# Altium schematic sheet LPDDR4 SDRAM_2.SchDoc
size 420 x 297 mm; SheetNumber: 13; SheetTotal: 26
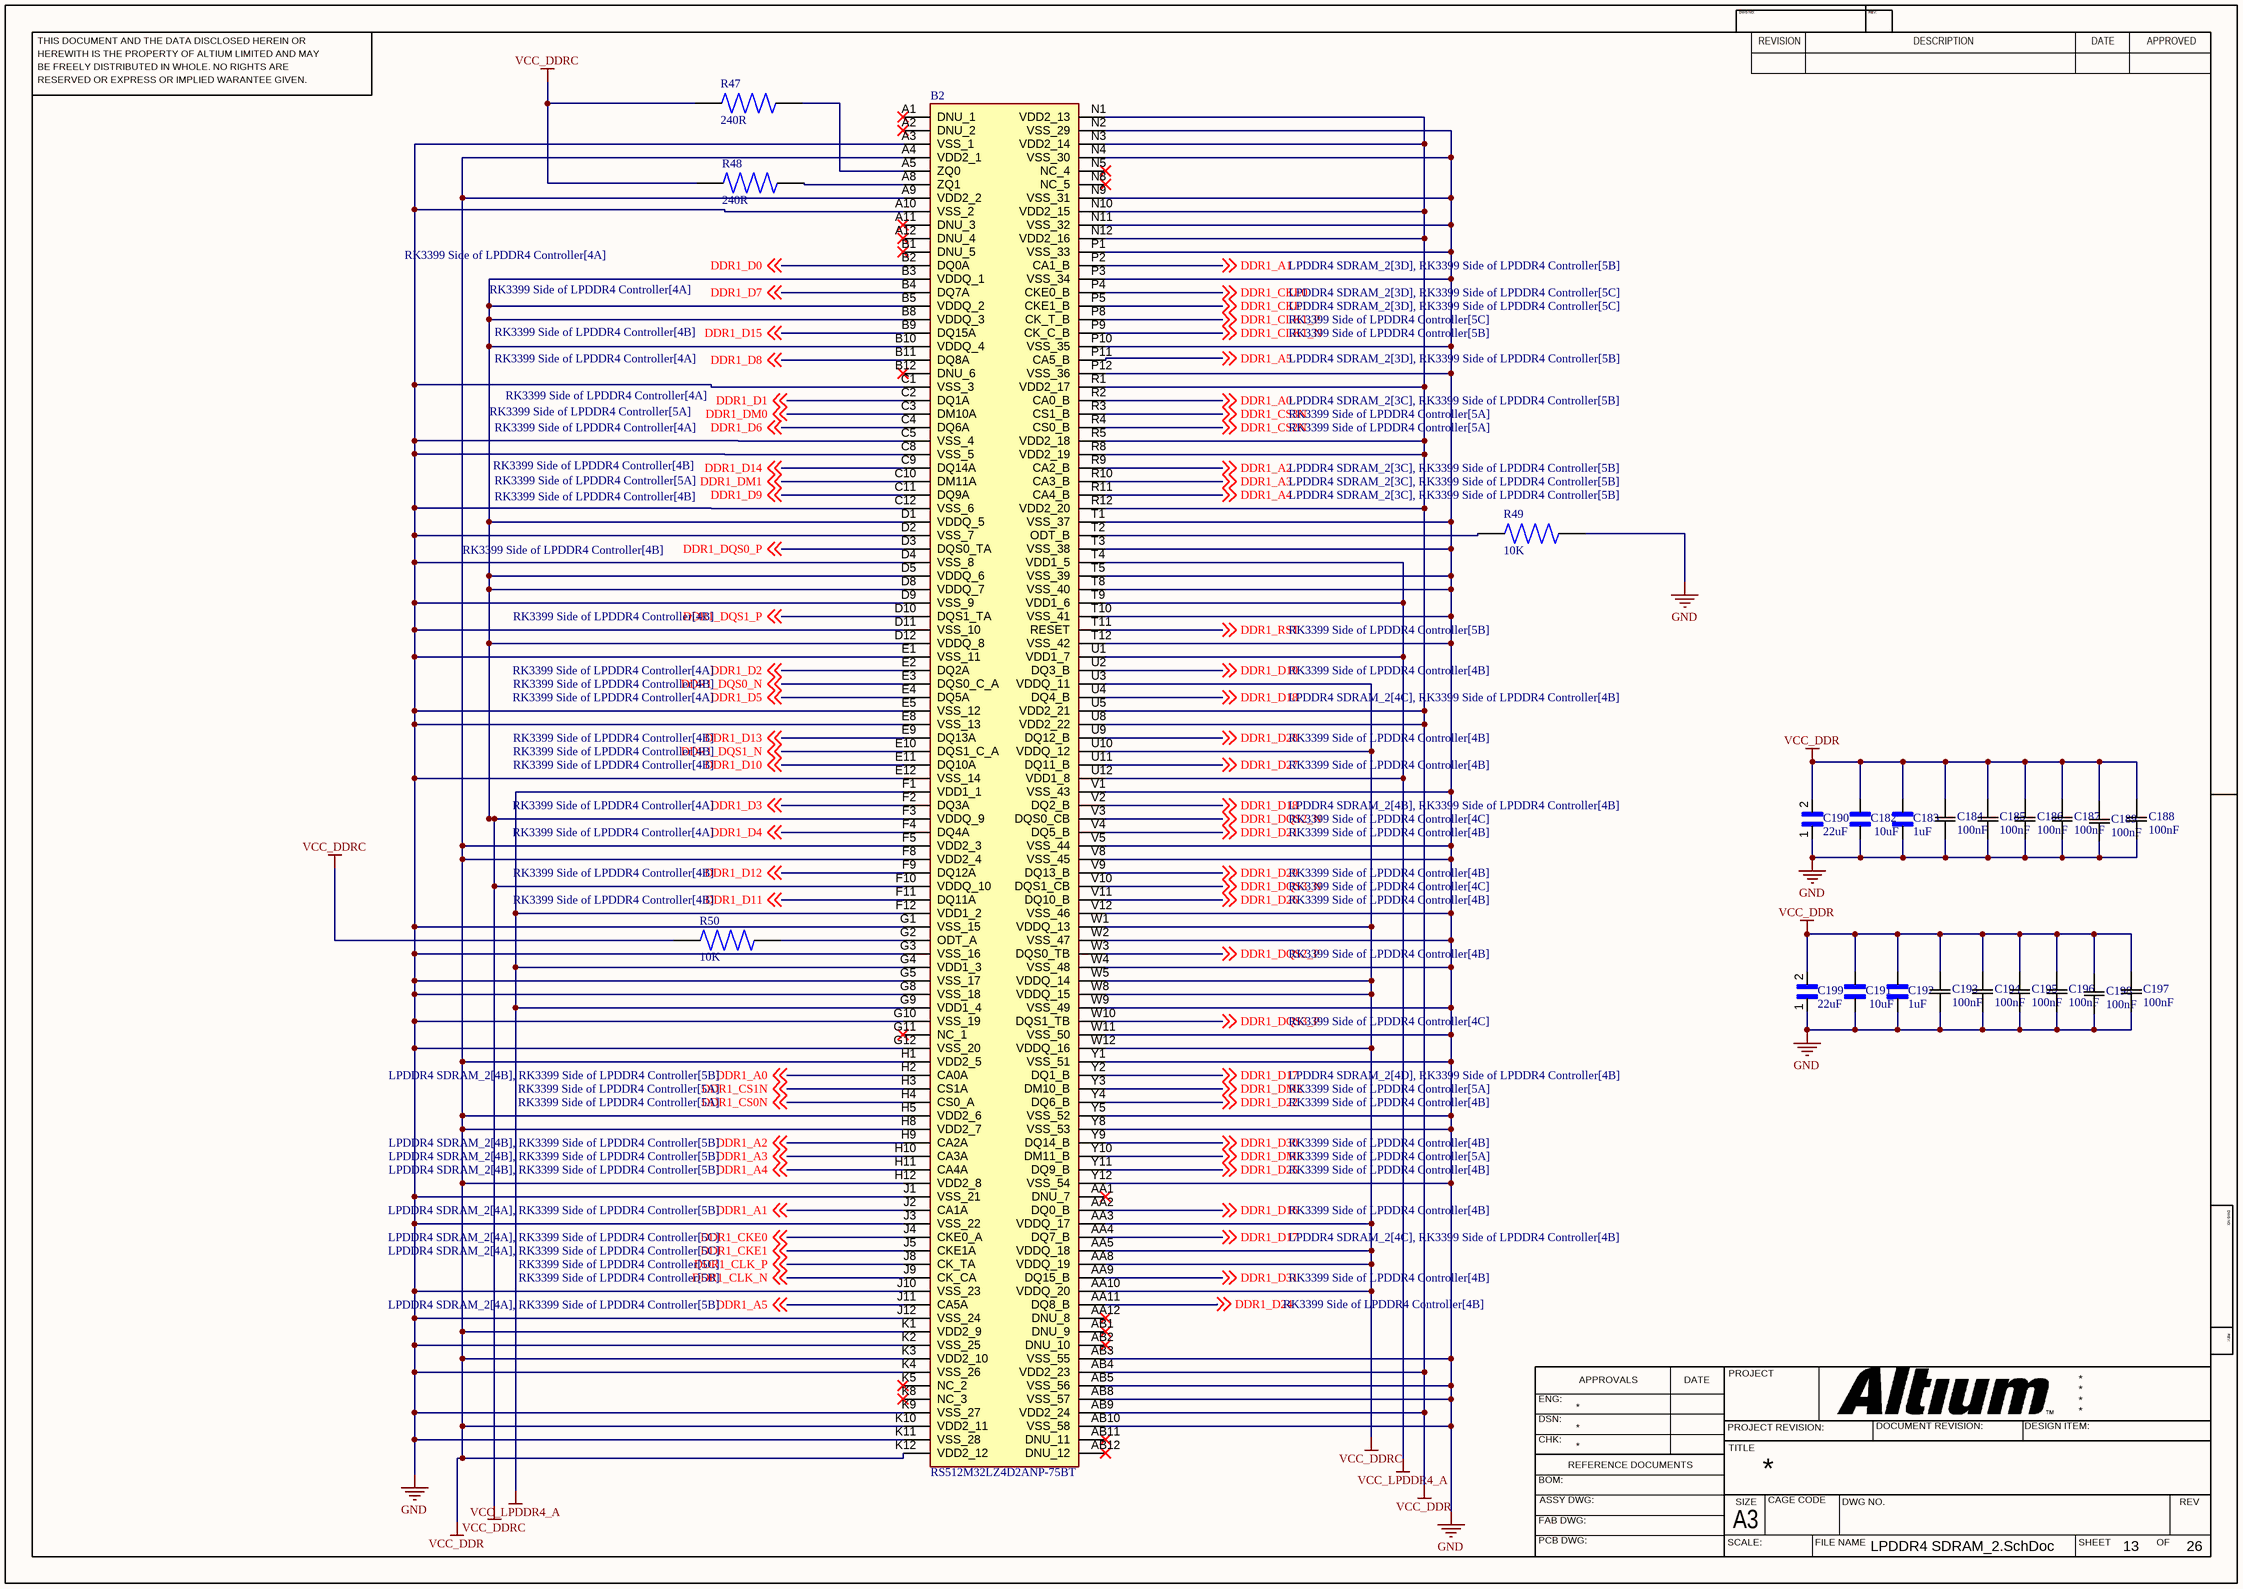
[diagram p0: LPDDR4 SDRAM_2.SchDoc]

## Parts
B2  RS512M32LZ4D2ANP-75BT  [BGA200C65P12X22_1000X1500X100]
C182  10uF  [CAPC1005X70N]
C183  1uF  [CAPC1005X56N]
C184  100nF  [CAP_1005_TDK]
C185  100nF  [CAP_1005_TDK]
C186  100nF  [CAP_1005_TDK]
C187  100nF  [CAP_1005_TDK]
C188  100nF  [CAP_1005_TDK]
C189  100nF  [CAP_1005_TDK]
C190  22uF  [CAPC6050X550N]
C191  10uF  [CAPC1005X70N]
C192  1uF  [CAPC1005X56N]
C193  100nF  [CAP_1005_TDK]
C194  100nF  [CAP_1005_TDK]
C195  100nF  [CAP_1005_TDK]
C196  100nF  [CAP_1005_TDK]
C197  100nF  [CAP_1005_TDK]
C198  100nF  [CAP_1005_TDK]
C199  22uF  [CAPC6050X550N]
R47  240R  [RESC1608X50N]
R48  240R  [RESC1608X50N]
R49  10K  [RESC1608X55N]
R50  10K  [RESC1608X55N]

## Nets
GND: B2.A3(VSS_1) B2.A10(VSS_2) B2.AB3(VSS_55) B2.AB5(VSS_56) B2.AB8(VSS_57) B2.AB10(VSS_58) B2.C1(VSS_3) B2.C5(VSS_4) B2.C8(VSS_5) B2.C12(VSS_6) B2.D2(VSS_7) B2.D4(VSS_8) B2.D9(VSS_9) B2.D11(VSS_10) B2.E1(VSS_11) B2.E5(VSS_12) B2.E8(VSS_13) B2.E12(VSS_14) B2.G1(VSS_15) B2.G3(VSS_16) B2.G5(VSS_17) B2.G8(VSS_18) B2.G10(VSS_19) B2.G12(VSS_20) B2.J1(VSS_21) B2.J3(VSS_22) B2.J10(VSS_23) B2.J12(VSS_24) B2.K2(VSS_25) B2.K4(VSS_26) B2.K9(VSS_27) B2.K11(VSS_28) B2.N2(VSS_29) B2.N4(VSS_30) B2.N9(VSS_31) B2.N11(VSS_32) B2.P1(VSS_33) B2.P3(VSS_34) B2.P10(VSS_35) B2.P12(VSS_36) B2.T1(VSS_37) B2.T3(VSS_38) B2.T5(VSS_39) B2.T8(VSS_40) B2.T10(VSS_41) B2.T12(VSS_42) B2.V1(VSS_43) B2.V5(VSS_44) B2.V8(VSS_45) B2.V12(VSS_46) B2.W2(VSS_47) B2.W4(VSS_48) B2.W9(VSS_49) B2.W11(VSS_50) B2.Y1(VSS_51) B2.Y5(VSS_52) B2.Y8(VSS_53) B2.Y12(VSS_54) C182.1 C183.1 C184.1 C185.1 C186.1 C187.1 C188.1 C189.1 C190.1 C191.1 C192.1 C193.1 C194.1 C195.1 C196.1 C197.1 C198.1 C199.1 R49.2
VCC_DDR: B2.A4(VDD2_1) B2.A9(VDD2_2) B2.AB4(VDD2_23) B2.AB9(VDD2_24) B2.F5(VDD2_3) B2.F8(VDD2_4) B2.H1(VDD2_5) B2.H5(VDD2_6) B2.H8(VDD2_7) B2.H12(VDD2_8) B2.K1(VDD2_9) B2.K3(VDD2_10) B2.K10(VDD2_11) B2.K12(VDD2_12) B2.N1(VDD2_13) B2.N3(VDD2_14) B2.N10(VDD2_15) B2.N12(VDD2_16) B2.R1(VDD2_17) B2.R5(VDD2_18) B2.R8(VDD2_19) B2.R12(VDD2_20) B2.U5(VDD2_21) B2.U8(VDD2_22) C182.2 C183.2 C184.2 C185.2 C186.2 C187.2 C188.2 C189.2 C190.2 C191.2 C192.2 C193.2 C194.2 C195.2 C196.2 C197.2 C198.2 C199.2
VCC_DDRC: B2.AA3(VDDQ_17) B2.AA5(VDDQ_18) B2.AA8(VDDQ_19) B2.AA10(VDDQ_20) B2.B3(VDDQ_1) B2.B5(VDDQ_2) B2.B8(VDDQ_3) B2.B10(VDDQ_4) B2.D1(VDDQ_5) B2.D5(VDDQ_6) B2.D8(VDDQ_7) B2.D12(VDDQ_8) B2.F3(VDDQ_9) B2.F10(VDDQ_10) B2.U3(VDDQ_11) B2.U10(VDDQ_12) B2.W1(VDDQ_13) B2.W5(VDDQ_14) B2.W8(VDDQ_15) B2.W12(VDDQ_16) R47.1 R48.1 R50.2
VCC_LPDDR4_A: B2.F1(VDD1_1) B2.F12(VDD1_2) B2.G4(VDD1_3) B2.G9(VDD1_4) B2.T4(VDD1_5) B2.T9(VDD1_6) B2.U1(VDD1_7) B2.U12(VDD1_8)
DDR1_A0: B2.H2(CA0A) B2.R2(CA0_B) ; off-sheet DDR1_A0
DDR1_A1: B2.J2(CA1A) B2.P2(CA1_B) ; off-sheet DDR1_A1
DDR1_A2: B2.H9(CA2A) B2.R9(CA2_B) ; off-sheet DDR1_A2
DDR1_A3: B2.H10(CA3A) B2.R10(CA3_B) ; off-sheet DDR1_A3
DDR1_A4: B2.H11(CA4A) B2.R11(CA4_B) ; off-sheet DDR1_A4
DDR1_A5: B2.J11(CA5A) B2.P11(CA5_B) ; off-sheet DDR1_A5
DDR1_CKE0: B2.J4(CKE0_A) B2.P4(CKE0_B) ; off-sheet DDR1_CKE0
DDR1_CKE1: B2.J5(CKE1A) B2.P5(CKE1_B) ; off-sheet DDR1_CKE1
DDR1_CLK1_N: B2.P9(CK_C_B) ; off-sheet DDR1_CLK1_N
DDR1_CLK1_P: B2.P8(CK_T_B) ; off-sheet DDR1_CLK1_P
DDR1_CLK_N: B2.J9(CK_CA) ; off-sheet DDR1_CLK_N
DDR1_CLK_P: B2.J8(CK_TA) ; off-sheet DDR1_CLK_P
DDR1_CS0N: B2.H4(CS0_A) ; off-sheet DDR1_CS0N
DDR1_CS1N: B2.H3(CS1A) ; off-sheet DDR1_CS1N
DDR1_CS2N: B2.R4(CS0_B) ; off-sheet DDR1_CS2N
DDR1_CS3N: B2.R3(CS1_B) ; off-sheet DDR1_CS3N
DDR1_D0: B2.B2(DQ0A) ; off-sheet DDR1_D0
DDR1_D1: B2.C2(DQ1A) ; off-sheet DDR1_D1
DDR1_D2: B2.E2(DQ2A) ; off-sheet DDR1_D2
DDR1_D3: B2.F2(DQ3A) ; off-sheet DDR1_D3
DDR1_D4: B2.F4(DQ4A) ; off-sheet DDR1_D4
DDR1_D5: B2.E4(DQ5A) ; off-sheet DDR1_D5
DDR1_D6: B2.C4(DQ6A) ; off-sheet DDR1_D6
DDR1_D7: B2.B4(DQ7A) ; off-sheet DDR1_D7
DDR1_D8: B2.B11(DQ8A) ; off-sheet DDR1_D8
DDR1_D9: B2.C11(DQ9A) ; off-sheet DDR1_D9
DDR1_D10: B2.E11(DQ10A) ; off-sheet DDR1_D10
DDR1_D11: B2.F11(DQ11A) ; off-sheet DDR1_D11
DDR1_D12: B2.F9(DQ12A) ; off-sheet DDR1_D12
DDR1_D13: B2.E9(DQ13A) ; off-sheet DDR1_D13
DDR1_D14: B2.C9(DQ14A) ; off-sheet DDR1_D14
DDR1_D15: B2.B9(DQ15A) ; off-sheet DDR1_D15
DDR1_D16: B2.AA2(DQ0_B) ; off-sheet DDR1_D16
DDR1_D17: B2.AA4(DQ7_B) B2.Y2(DQ1_B) ; off-sheet DDR1_D17
DDR1_D18: B2.U4(DQ4_B) B2.V2(DQ2_B) ; off-sheet DDR1_D18
DDR1_D19: B2.U2(DQ3_B) ; off-sheet DDR1_D19
DDR1_D21: B2.V4(DQ5_B) ; off-sheet DDR1_D21
DDR1_D22: B2.Y4(DQ6_B) ; off-sheet DDR1_D22
DDR1_D24: B2.AA11(DQ8_B) ; off-sheet DDR1_D24
DDR1_D25: B2.Y11(DQ9_B) ; off-sheet DDR1_D25
DDR1_D26: B2.V11(DQ10_B) ; off-sheet DDR1_D26
DDR1_D27: B2.U11(DQ11_B) ; off-sheet DDR1_D27
DDR1_D28: B2.U9(DQ12_B) ; off-sheet DDR1_D28
DDR1_D29: B2.V9(DQ13_B) ; off-sheet DDR1_D29
DDR1_D30: B2.Y9(DQ14_B) ; off-sheet DDR1_D30
DDR1_D31: B2.AA9(DQ15_B) ; off-sheet DDR1_D31
DDR1_DM0: B2.C3(DM10A) ; off-sheet DDR1_DM0
DDR1_DM1: B2.C10(DM11A) ; off-sheet DDR1_DM1
DDR1_DM2: B2.Y3(DM10_B) ; off-sheet DDR1_DM2
DDR1_DM3: B2.Y10(DM11_B) ; off-sheet DDR1_DM3
DDR1_DQS0_N: B2.E3(DQS0_C_A) ; off-sheet DDR1_DQS0_N
DDR1_DQS0_P: B2.D3(DQS0_TA) ; off-sheet DDR1_DQS0_P
DDR1_DQS1_N: B2.E10(DQS1_C_A) ; off-sheet DDR1_DQS1_N
DDR1_DQS1_P: B2.D10(DQS1_TA) ; off-sheet DDR1_DQS1_P
DDR1_DQS2_N: B2.V3(DQS0_CB) ; off-sheet DDR1_DQS2_N
DDR1_DQS2_P: B2.W3(DQS0_TB) ; off-sheet DDR1_DQS2_P
DDR1_DQS3_N: B2.V10(DQS1_CB) ; off-sheet DDR1_DQS3_N
DDR1_DQS3_P: B2.W10(DQS1_TB) ; off-sheet DDR1_DQS3_P
DDR1_RST: B2.T11(RESET) ; off-sheet DDR1_RST
NetB2_A5: B2.A5(ZQ0) R47.2
NetB2_A8: B2.A8(ZQ1) R48.2
NetB2_G2: B2.G2(ODT_A) R50.1
NetB2_T2: B2.T2(ODT_B) R49.1

Not connected (* = marked no-connect by the designer): B2 A1(DNU_1)* A2(DNU_2)* A11(DNU_3)* A12(DNU_4)* AA1(DNU_7)* AA12(DNU_8)* AB1(DNU_9)* AB2(DNU_10)* AB11(DNU_11)* AB12(DNU_12)* B1(DNU_5)* B12(DNU_6)* G11(NC_1)* K5(NC_2)* K8(NC_3)* N5(NC_4)* N8(NC_5)*

## Notes on the sheet
- THIS DOCUMENT AND THE DATA DISCLOSED HEREIN OR
- HEREWITH IS THE PROPERTY OF ALTIUM LIMITED AND MAY
- DWG NO:
- REVISION
- REV:
- DESCRIPTION
- DATE
- APPROVED
- BE FREELY DISTRIBUTED IN WHOLE. NO RIGHTS ARE
- RESERVED OR EXPRESS OR IMPLIED WARANTEE GIVEN.
- ENG:
- APPROVALS
- PROJECT
- DSN:
- CHK:
- REFERENCE DOCUMENTS
- PROJECT REVISION:
- TITLE
- DOCUMENT REVISION:
- DESIGN ITEM:
- BOM:
- FAB DWG:
- PCB DWG:
- ASSY DWG:
- SCALE:
- A3
- SIZE
- CAGE CODE
- FILE NAME
- DWG NO.
- SHEET
- OF
- REV

## Library data of the parts
B2 = RS512M32LZ4D2ANP-75BT: BGA-200 New Arrivals ROHS; Manufacturer_Name: Rayson; Geometry.Height: 1mm; Manufacturer_Part_Number: RS512M32LZ4D2ANP-75BT; Mouser Part Number: *; Mouser Price/Stock: *; Arrow Part Number: *; Arrow Price/Stock: *; Datasheet Link: https://www.szrayson.com/uploadfiles/2020/05/20200519174828010.pdf
C182 C191 = CL05A106MQ5NUNC: 10 ÂµF Â±20% 6.3V Ceramic Capacitor X5R 0402 (1005 Metric); MF: Samsung; SnapEDA_Link: https://www.snapeda.com/parts/CL05A106MQ5NUNC/Samsung/view-part/?ref=snap; Package: SMD-2 Samsung; Value: *; MP: CL05A106MQ5NUNC; Check_prices: https://www.snapeda.com/parts/CL05A106MQ5NUNC/Samsung/view-part/?ref=eda
C183 C192 = 0402ZD105KAT4A: 1 ÂµF Â±10% 10V Ceramic Capacitor X5R 0402 (1005 Metric); MF: AVX; SnapEDA_Link: https://www.snapeda.com/parts/0402ZD105KAT4A/AVX/view-part/?ref=snap; Package: 1005 AVX; Value: *; MP: 0402ZD105KAT4A; Check_prices: https://www.snapeda.com/parts/0402ZD105KAT4A/AVX/view-part/?ref=eda
C184-C189 C193-C198 = C1005X7R1H104M050BB: Description; Manufacturer_Name: TDK; Copyright: Copyright (C) 2025 Ultra Librarian. All rights reserved.; Manufacturer_Part_Number: C1005X7R1H104M050BB
C190 C199 = CKG57NX7S1H226M500JJ: 22ÂµF Â±20% 50V Ceramic Capacitor X7S Stacked SMD, 2 J-Lead; MP: CKG57NX7S1H226M500JJ; Package: None; Availability: Unavailable; Price: None; Value: *
R47 R48 = ERA6AED241V: Value: *; Availability: Unavailable; Price: None; Package: None; MP: ERA6AED241V
R49 R50 = CRCW06031K00FKECC: 1 kOhms Â±1% 0.1W, 1/10W Chip Resistor 0603 (1608 Metric) - Thick Film; MF: Vishay; SnapEDA_Link: https://www.snapeda.com/parts/CRCW06031K00FKECC/Vishay/view-part/?ref=snap; Package: 0603-2 Vishay; Value: *; MP: CRCW06031K00FKECC; Check_prices: https://www.snapeda.com/parts/CRCW06031K00FKECC/Vishay/view-part/?ref=eda